# Altium schematic sheet Lampi.SchDoc
size A
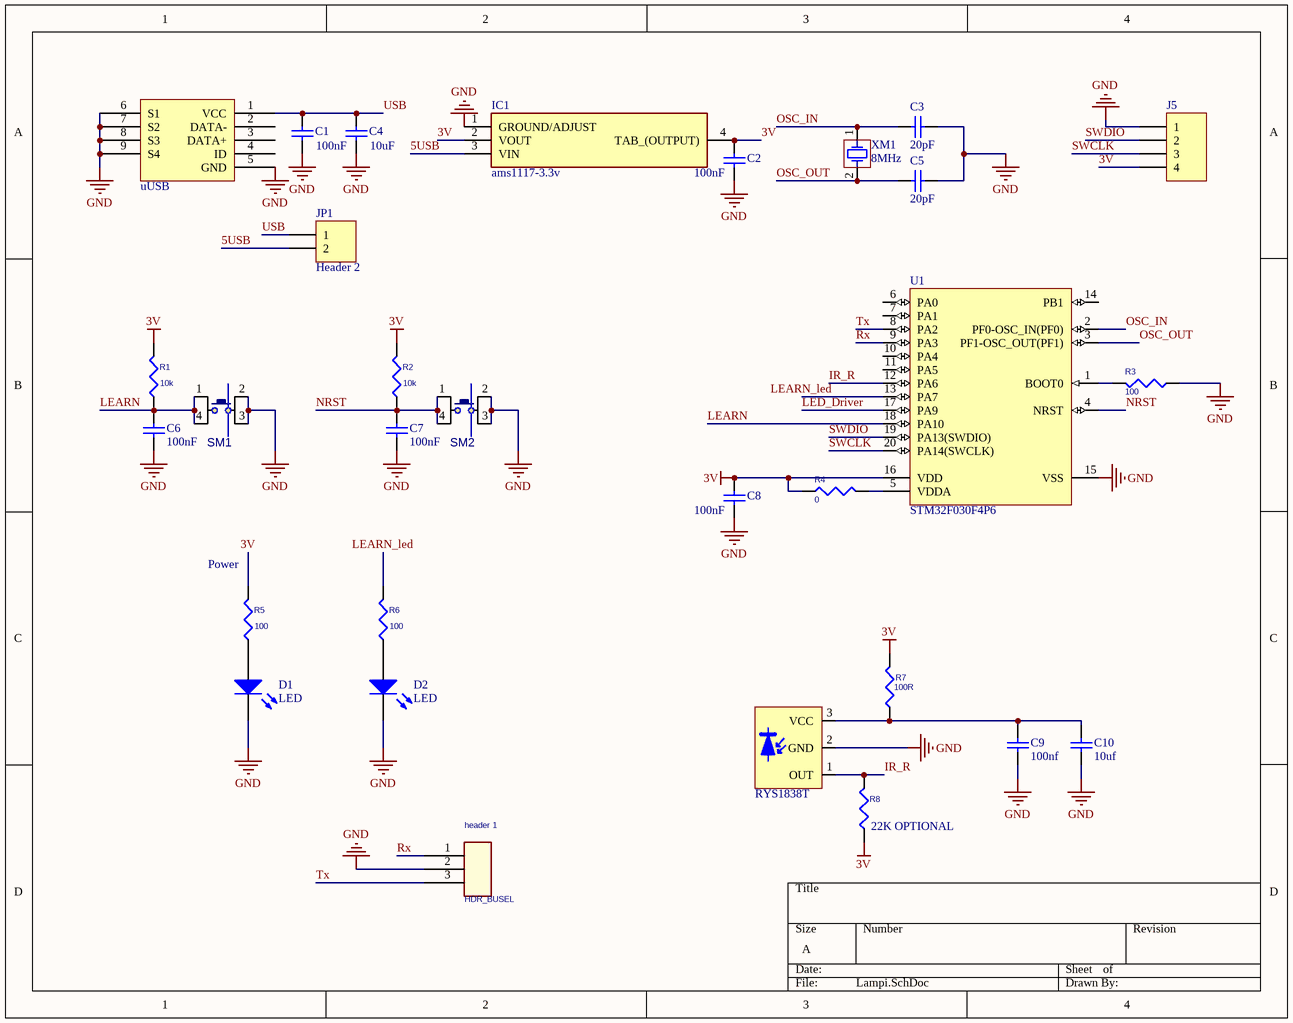
[diagram p0: Lampi.SchDoc]

## Parts
?  RYS1838T  [RYS1838T]
C1  100nF  [0805C]
C2  100nF  [0805C]
C3  20pF  [1206C]
C4  10uF  [0805C]
C5  20pF  [1206C]
C6  100nF  [0805C]
C7  100nF  [0805C]
C8  100nF  [0805C]
C9  100nf  [0805C]
C10  10uf  [0805C]
D1  LED  [L1206]
D2  LED  [L1206]
header_1  HDR_BUSEL  [HDR_1x3]
IC1  ams1117-3.3v  [SOT229P700X180-4N]
J5  (no value)  [HEADER_4_JMP]
JP1  Header 2  [COMM HEADER 2]
R1  10k  [0805L]
R2  10k  [0805L]
R3  100  [0805L]
R4  0  [0805L]
R5  100  [0805L]
R6  100  [0805L]
R7  100R  [0805L]
R8  22K OPTIONAL  [0805L]
SM1  PUSHBUTTON  [PBTHD_4_6X6MM]  (value not drawn)
SM2  PUSHBUTTON  [PBTHD_4_6X6MM]  (value not drawn)
U1  STM32F030F4P6  [STM-TSSOP20_L]
uUSB  micro usb dip  [MICRO_USB_DIP]  (value not drawn)
XM1  8MHz  [XTLT_2]

## Nets
3V: C2.2 C8.2 IC1.2(VOUT) IC1.4(TAB_(OUTPUT)) J5.4 R1.2 R2.2 R4.1 R5.2 R7.2 R8.1 U1.16(VDD)
GND: ?.2(GND) C1.1 C2.1 C3.2 C4.1 C5.2 C6.1 C7.1 C8.1 C9.2 C10.2 D1.K D2.K header_1.2 IC1.1(GROUND/ADJUST) J5.1 R3.1 SM1.2(P3) SM1.3(P4) SM2.2(P3) SM2.3(P4) U1.15(VSS) uUSB.5(GND) uUSB.6(S1) uUSB.7(S2) uUSB.8(S3) uUSB.9(S4)
5USB: IC1.3(VIN) JP1.2
IR_R: ?.1(OUT) R8.2 U1.12(PA6)
LEARN: C6.2 R1.1 SM1.1(P1) SM1.4(P2) U1.18(PA10)
LEARN_led: R6.2 U1.13(PA7)
LED_Driver: U1.17(PA9)
NRST: C7.2 R2.1 SM2.1(P1) SM2.4(P2) U1.4(NRST)
OSC_IN: C3.1 U1.2(PF0-OSC_IN(PF0)) XM1.1(OSC1)
OSC_OUT: C5.1 U1.3(PF1-OSC_OUT(PF1)) XM1.2(OSC2)
Rx: header_1.1 U1.9(PA3)
SWCLK: J5.3 U1.20(PA14(SWCLK))
SWDIO: J5.2 U1.19(PA13(SWDIO))
Tx: header_1.3 U1.8(PA2)
USB: C1.2 C4.2 JP1.1 uUSB.1(VCC)
Net?_3: ?.3(VCC) C9.1 C10.1 R7.1
NetD1_A: D1.A R5.1
NetD2_A: D2.A R6.1
NetR3_2: R3.2 U1.1(BOOT0)
NetR4_2: R4.2 U1.5(VDDA)

Not connected (* = marked no-connect by the designer): U1 6(PA0) 7(PA1) 10(PA4) 11(PA5) 14(PB1); uUSB 2(DATA-) 3(DATA+) 4(ID)

## Notes on the sheet
- (near R5) Power

## Library data of the parts
C1 C2 C8 = Cap: Value: 100nF
C3 C5-C7 C9 C10 = Cap: Capacitor
  C3 C5: Value: 20pF
  C6 C7: Value: 100nF
  C9: Value: 100nf
  C10: Value: 10uf
C4 = Cap: 100nF; Value: 10uF
header_1 = header 1x3
IC1 = ams1117-3.3v: Integrated Circuit; Manufacturer_Name: Advanced Monolithic Systems; Datasheet Link: http://www.advanced-monolithic.com/pdf/ds1117.pdf; Height: 1.8mm; Manufacturer_Part_Number: ams1117-3.3v
J5 = Header 4: Header, 4-Pin; LatestRevisionDate: 17-Jul-2002; LatestRevisionNote: Re-released for DXP Platform.; Publisher: Altium Limited
JP1 = Header 2: Header, 2-Pin; LatestRevisionDate: 17-Jul-2002; LatestRevisionNote: Re-released for DXP Platform.; Publisher: Altium Limited
R1-R8 = R
  R1-R6: Value: *
  R7: Value: 100r
  R8: Value: 22K OPTIONAL
SM1 SM2 = PUSHBUTTON4: SWITCH TACT 6MM 100GF SMD; MANF_PART#: TL3301EF100QG; MANF: ESWITCH; DESC: DESCRIPTION; VALUE: PUSHBUTTON; ASSEMBLY: ASSEMBLY; PARAM: PARAM; PRICE: PRICE
U1 = STM32F030F4P6: ARM Cortex-M0 32-bit MCU, 16 KB Flash, 4 KB Internal RAM, 15 I/Os, 20-pin TSSOP, -40 to 85 degC, Tube; FLASH Size (Prog) (kB): 16; I/Os (High Current): 15; Internal RAM Size (kB): 4; Operating Frequency(F) (Processor speed) (MHz): 48; Supply Voltage(Vcc) min (V): 2.4; DatasheetVersion: Rev. 1; PackageVersion: Rev. 1, 11/2012; PackageReference: TSSOP20; PackageDescription: 20-Pin Thin Shrink Small Outline Package, 6.5 x 4.4 mm Body, 0.65 mm Pitch; Supplier 1: Digi-Key; Supplier Part Number 1: 497-14044-5-ND; Supplier 2: Newark; Supplier Part Number 2: 06X3648; Supplier 3: Mouser; Supplier Part Number 3: 511-STM32F030F4P6; Core: ARM Cortex-M0; Packing: Tube; Mounting Technology: Surface Mount; PartNumber: STM32F030F4P6; ComponentLink1Description: Manufacturer URL; ComponentLink1URL: http://www.st.com/web/en/home.html; ComponentLink2Description: Datasheet; ComponentLink2URL: http://www.st.com/st-web-ui/static/active/en/resource/technical/document/datasheet/DM00088500.pdf; ComponentLink3Description: Package Specification; ComponentLink3URL: http://www.st.com/st-web-ui/static/active/en/resource/technical/document/datasheet/DM00065136.pdf
XM1 = XTAL